# Altium schematic sheet Main.SchDoc
size A4; DocumentNumber: 1; SheetNumber: 1
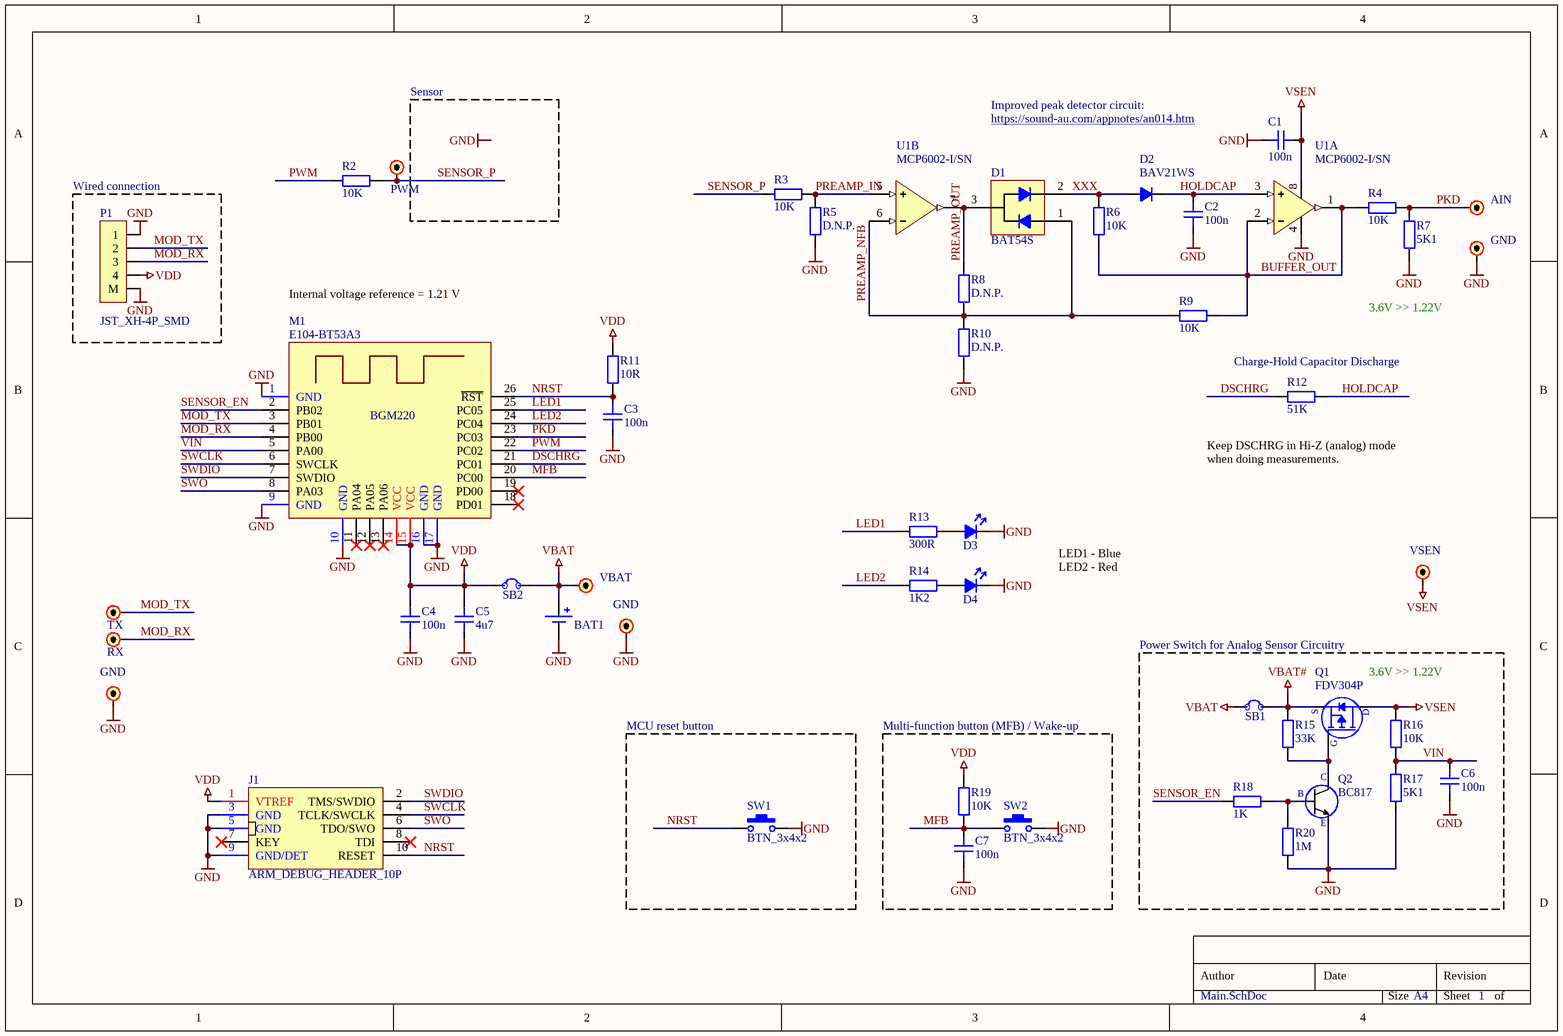
[diagram p0: Main.SchDoc]

## Parts
BAT1  WURTH_79527141  [WURTH_79527141_NO_T-SILK]  (value not drawn)
C1  100n  [0603C_RF_M]
C2  100n  [0603C_RF_M]
C3  100n  [0603C_RF_M]
C4  100n  [0603C_RF_M]
C5  4u7  [0603C_RF_M]
C6  100n  [0603C_RF_M]
C7  100n  [0603C_RF_M]
D1  BAT54S  [IRLML_SOT-23]
D2  BAV21WS  [D_SOD-323]
D3  Unspecified  [0805LED_RF_M]  (value not drawn)
D4  Unspecified  [0805LED_RF_M]  (value not drawn)
J1  ARM_DEBUG_HEADER_10P  [ARM_CORTEX_DEBUG_HEADER-1.27-10P-2R_NOMASK]
M1  E104-BT53A3  [E104-BT53A3]
P1  JST_XH-4P_SMD  [S4BXHSM4TBLFSN]
Q1  FDV304P  [IRLML_SOT-23]
Q2  BC817  [IRLML_SOT-23]
R2  10K  [0603R_RF_M]
R3  10K  [0603R_RF_M]
R4  10K  [0603R_RF_M]
R5  D.N.P.  [0603R_RF_M]
R6  10K  [0603R_RF_M]
R7  5K1  [0603R_RF_M]
R8  D.N.P.  [0603R_RF_M]
R9  10K  [0603R_RF_M]
R10  D.N.P.  [0603R_RF_M]
R11  10R  [0603R_RF_M]
R12  51K  [0603R_RF_M]
R13  300R  [0603R_RF_M]
R14  1K2  [0603R_RF_M]
R15  33K  [0603R_RF_M]
R16  10K  [0603R_RF_M]
R17  5K1  [0603R_RF_M]
R18  1K  [0603R_RF_M]
R19  10K  [0603R_RF_M]
R20  1M  [0603R_RF_M]
SB1  Solder Bridge  [SLDR_BRDG_0603_OPEN]  (value not drawn)
SB2  Solder Bridge  [SLDR_BRDG_0603_OPEN]  (value not drawn)
SW1  BTN_3x4x2  [BTN_3x4x2]
SW2  BTN_3x4x2  [BTN_3x4x2]
TP1  PWM  [PAD_R_1MM]
TP2  VSEN  [PAD_R_1MM]
TP4  AIN  [PAD_R_1MM]
TP5  GND  [PAD_R_1MM]
TP6  VBAT  [PAD_R_1MM]
TP7  TX  [PAD_R_1MM]
TP8  GND  [PAD_R_1MM]
TP9  RX  [PAD_R_1MM]
TP10  GND  [PAD_R_1MM]
U1  MCP6002-I/SN  [SOIC-8]  (parts A,B of 2)

## Blocks framed on the sheet
Wired connection: P1
MCU reset button: SW1
Multi-function button (MFB) / Wake-up: C7 R19 SW2

## Nets
GND: BAT1.N C1.2 C2.2 C3.1 C4.1 C5.1 C6.2 C7.1 D3.C D4.C J1.3(GND) J1.5(GND) J1.9(GND/DET) M1.1(GND) M1.9(GND) M1.10(GND) M1.16(GND) M1.17(GND) P1.1 P1.MNT(M) Q2.2(Emmiter) R5.1 R7.1 R10.1 R17.1 R20.1 SW1.2 SW2.2 TP5.1 TP8.1 TP10.1 U1.4
VBAT: BAT1.P SB1.1 SB2.2 TP6.1
VBAT#: Q1.2(Source) R15.2 SB1.2
VDD: C4.2 C5.2 J1.1(VTREF) M1.14(VCC) M1.15(VCC) P1.4 R11.2 R19.2 SB2.1
VSEN: C1.1 Q1.3(Drain) R16.2 TP2.1 U1.8
BUFFER_OUT: R4.1 R6.2 R9.2 U1.1 U1.2
DSCHRG: M1.21(PC01) R12.1
HOLDCAP: C2.1 D2.C R12.2 U1.3
LED1: M1.25(PC05) R13.1
LED2: M1.24(PC04) R14.1
MFB: C7.2 M1.20(PC00) R19.1 SW2.1
MOD_RX: M1.4(PB00) P1.3 TP9.1
MOD_TX: M1.3(PB01) P1.2 TP7.1
NRST: C3.2 J1.10(RESET) M1.26(~{RST}) R11.1 SW1.1
PKD: M1.23(PC03) R4.2 R7.2 TP4.1
PREAMP_IN: R3.2 R5.2 U1.5
PREAMP_NFB: D1.1(A1) R8.1 R9.1 R10.2 U1.6
PREAMP_OUT: D1.3(C) R8.2 U1.7
PWM: M1.22(PC02) R2.1
SENSOR_EN: M1.2(PB02) R18.1
SENSOR_P: R2.2 R3.1 TP1.1
SWCLK: J1.4(TCLK/SWCLK) M1.6(SWCLK)
SWDIO: J1.2(TMS/SWDIO) M1.7(SWDIO)
SWO: J1.6(TDO/SWO) M1.8(PA03)
VIN: C6.1 M1.5(PA00) R16.1 R17.2
XXX: D1.2(A2) D2.A R6.1
NetD3_A: D3.A R13.2
NetD4_A: D4.A R14.2
NetQ1_1: Q1.1(Gate) Q2.3(Collector) R15.1
NetQ2_1: Q2.1(Base) R18.2 R20.2

Not connected (* = marked no-connect by the designer): J1 7(KEY)* 8(TDI)*; M1 11(PA04)* 12(PA05)* 13(PA06)* 18(PD01)* 19(PD00)*

## Notes on the sheet
- Sensor
- Improved peak detector circuit:
- https://sound-au.com/appnotes/an014.htm
- Internal voltage reference = 1.21 V
- 3.6V >> 1.22V
- (near R12) Charge-Hold Capacitor Discharge
- (near R12) Keep DSCHRG in Hi-Z (analog) mode when doing measurements.
- LED1 - Blue
  LED2 - Red
- Power Switch for Analog Sensor Circuitry
- Labels drawn without touching a wire or pin: GND
- Author
- Date
- Revision
- Size
- A4
- Sheet
- of
- (in symbol BC817-40-215) C; B; E
- (in symbol E104-BT53A3) BGM220
- (in symbol FDV304P) S; D; G

## Library data of the parts
BAT1 = WURTH_79527141: BATT HOLDER COIN 20MM 1 CELL SMD; Manufacturer: Wurth Electronik; Cell Type: CR2032; Mounting Technology: SMT; Manufacturer Part No: 79527141
C1-C7 = C: Capacitor; Manufacturer: Generic Brand; Max Voltage: ? V; Tolerance: ?; Mounting Technology: SMT; Tag: *; Manufacturer Part No: *; Supplier: *; Supplier Link: http://; Supplier Part No: *; Category: Capacitor
  C1-C4 C6 C7: Value: 100n
  C5: Value: 4u7
D1 = BAT54S: DIODE ARRAY SCHOTTKY SERIES 30V 0.2A SOT-23; Manufacturer: Diodes Incorporated; DiodeConfiguration: 1 Pair Series; BaseProduct: BAT54S; Supplier: DigiKey; MountingTechnology: SMT; UnitPrice: $0.18; Package: SOT-23-3
D2 = BAV21WS: DIODE GEN PURP 200V 200MA SOD323; Manufacturer: Diotec; Manufacturer Product Number: BAV21WS-7-F; Similar Part: *; Supplier Part No: 9000771572; Supplier URL: https://www.chipdip.by/product/bav21ws-diotec; Mounting Technology: SMT; Package: SOD-323; Supplier: ChipDip
D3 D4 = LED: Manufacturer: Generic Brand; Forward Voltage Drop: ? V; Emitting Color: Unspecified; Manufacturer Part No: *; Supplier: *; Supplier Link: http://; Supplier Part No: *; Category: Diode; Mounting Technology: SMT
J1 = ARM_DEBUG_HEADER_10P: ARM Cortex Debug 10-Pin Header
M1 = E104-BT53A3: RXTX MOD BLUETOOTH SOC EFR32BG22C224F512GM32
Q1 = FDV304P: MOSFET P-CH 25V 460MA SOT23; Manufacturer: ON Semiconductor (Fairchild); Supplier Part No: 9000231252; Supplier: ChipDip; Supplier Link: https://www.chipdip.by/product/fdv304p-2; Mounting Technology: SMT; Package: SOT-23; Manufacturer Part No: FDV304P
Q2 = BC817-40-215: TRANS NPN 45V 0.5A SOT23; Manufacturer: Nexperia USA Inc.; Manufacturer Part No: BC817-40,215; Collector Current: 500 mA; Collector-Emitter Breakdown Voltage: 45V (max.); Power Dissipation: 250 mW; DC Current Gain: 250 @ 100mA, 1V; Supplier: DigiKey; Supplier Link: https://www.digikey.com/en/products/detail/nexperia-usa-inc/BC817-40-215/763235; Supplier Part No: 1727-2919-1-ND; Mounting Technology: SMT; Category: Transistor/BJT; Alternative Supplier: Chipdip; Alternative Supplier Link: https://www.chipdip.by/product/bc817-40; Alternative Supplier Part No: 28806907; Datasheet Link: https://assets.nexperia.com/documents/data-sheet/BC817_SER.pdf; Package: SOT-23
R2-R20 = R: Resistor; Manufacturer: Generic Brand; Power Rating: ? W; Max Voltage: ? V; Tolerance: ?; Supplier Link: http://; Category: Resistor; Mounting Technology: SMT
  R2-R4 R6 R9 R16 R19: Value: 10K
  R5 R8 R10: Value: D.N.P.
  R7 R17: Value: 5K1
  R11: Value: 10R
  R12: Value: 51K
  R13: Value: 300R
  R14: Value: 1K2
  R15: Value: 33K
  R18: Value: 1K
  R20: Value: 1M
SW1 SW2 = BTN_3x4x2: Switch Micro SMD 3x4x2 mm Unbranded; Supplier Link: https://aliexpress.ru/item/32855106640.html; Supplier: AliExpress
TP1 TP2 TP4-TP10 = Test Point: Test Point / Pad
U1 = MCP6002-I/SN: IC OPAMP GP 2 CIRCUIT 8SOIC